# EAGLE design ESP32 Miner LCD-2.4 inch  V1.0 251225(1) (EAGLE 9.5.1)
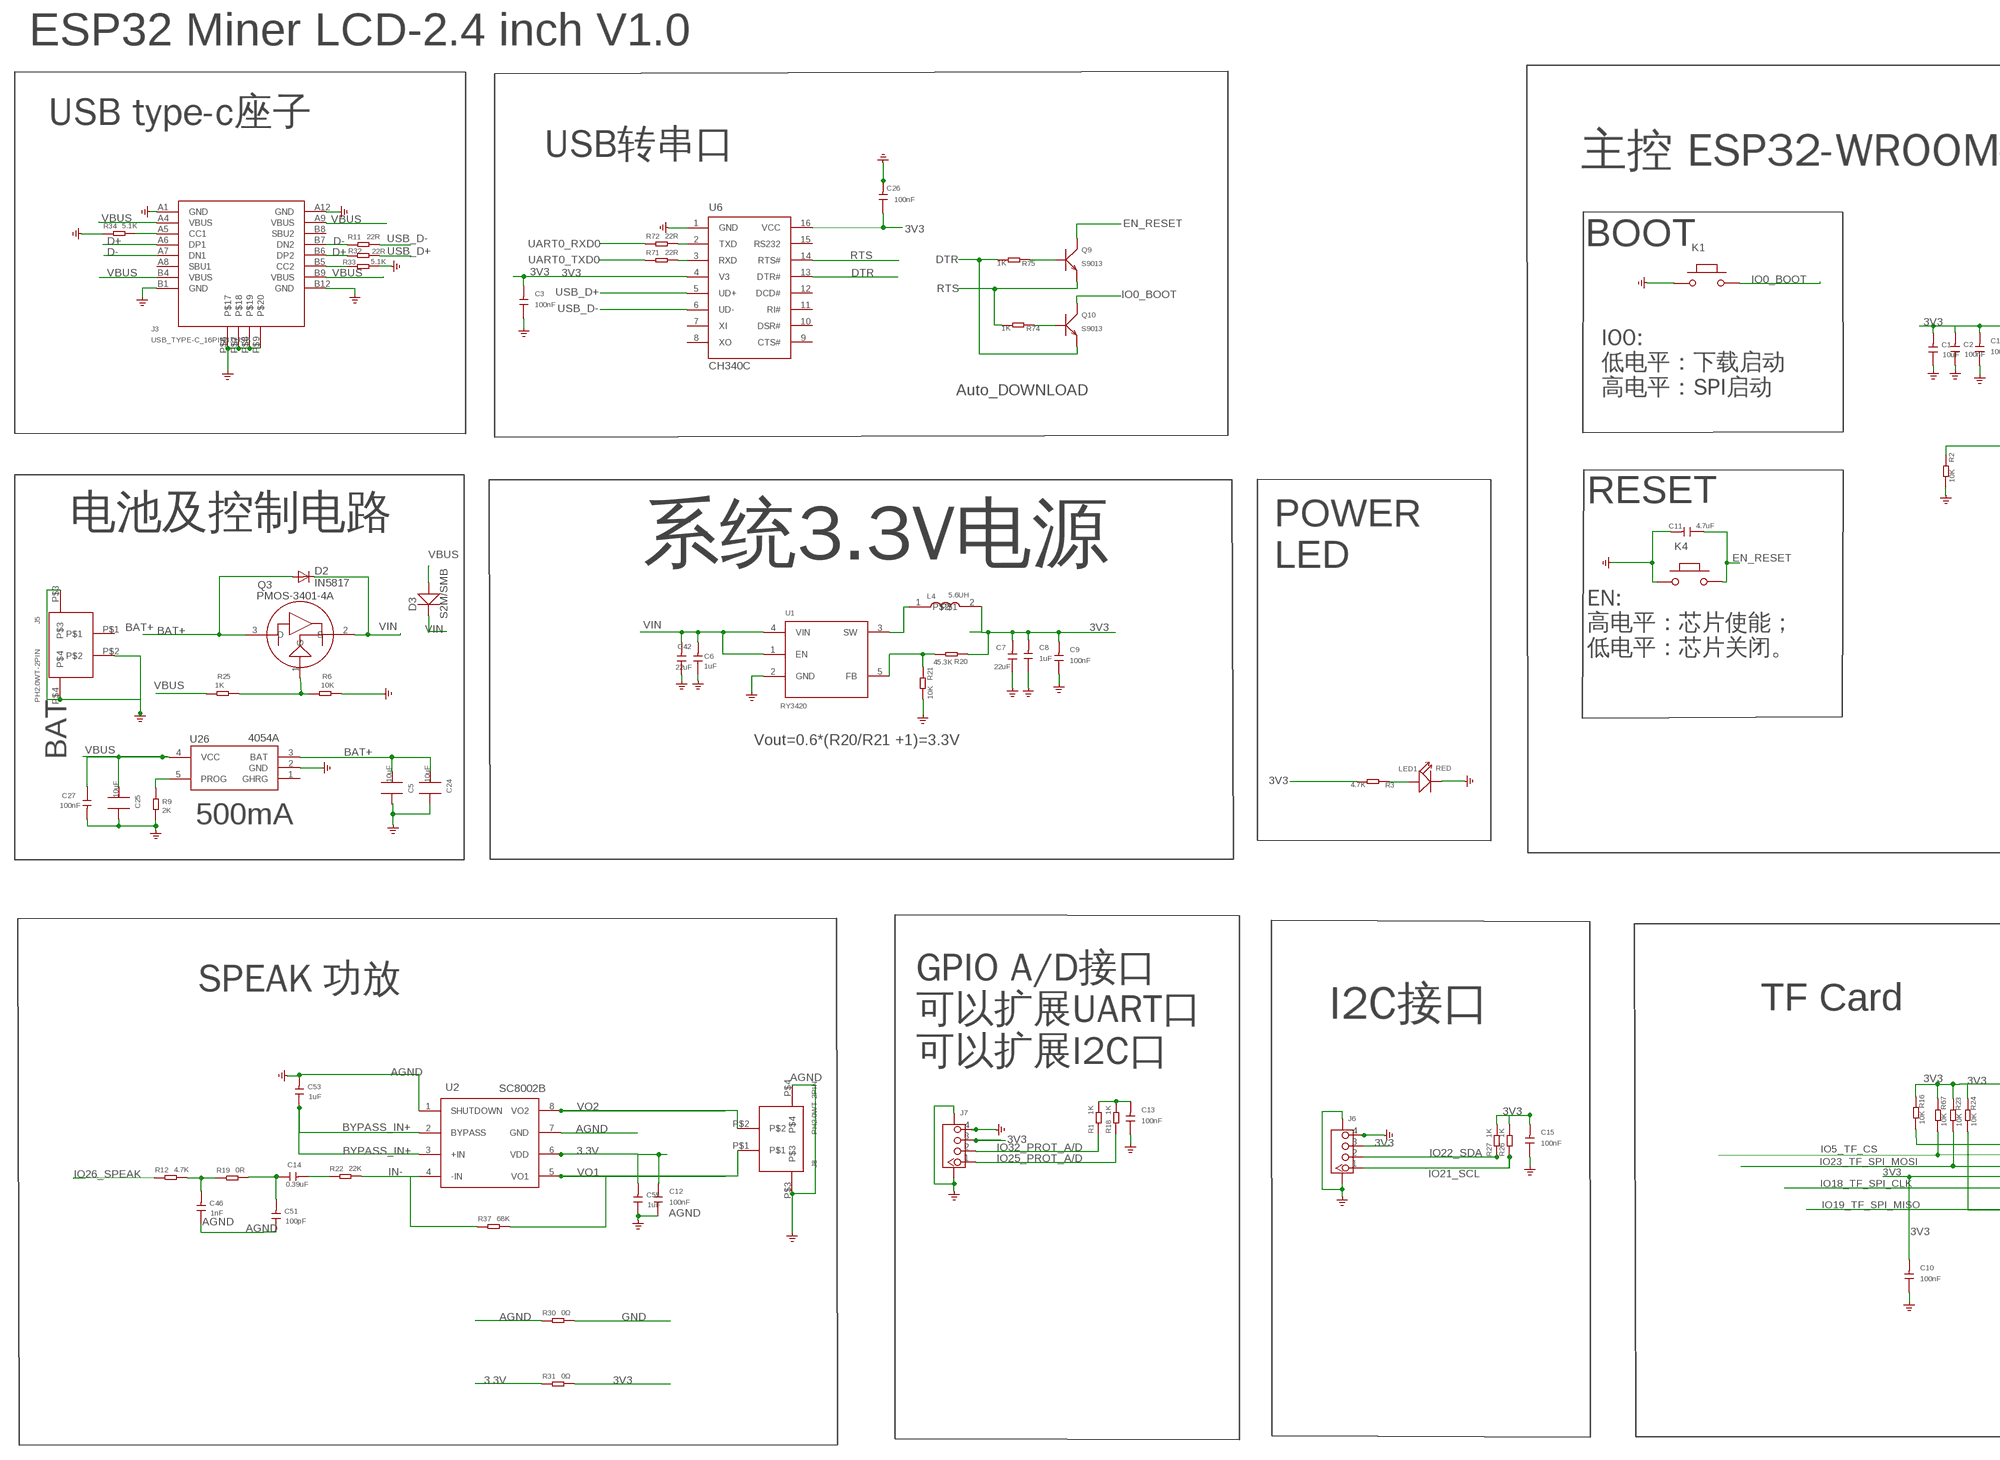
[diagram p0: schematic, sheet 1, part 1 of 2]
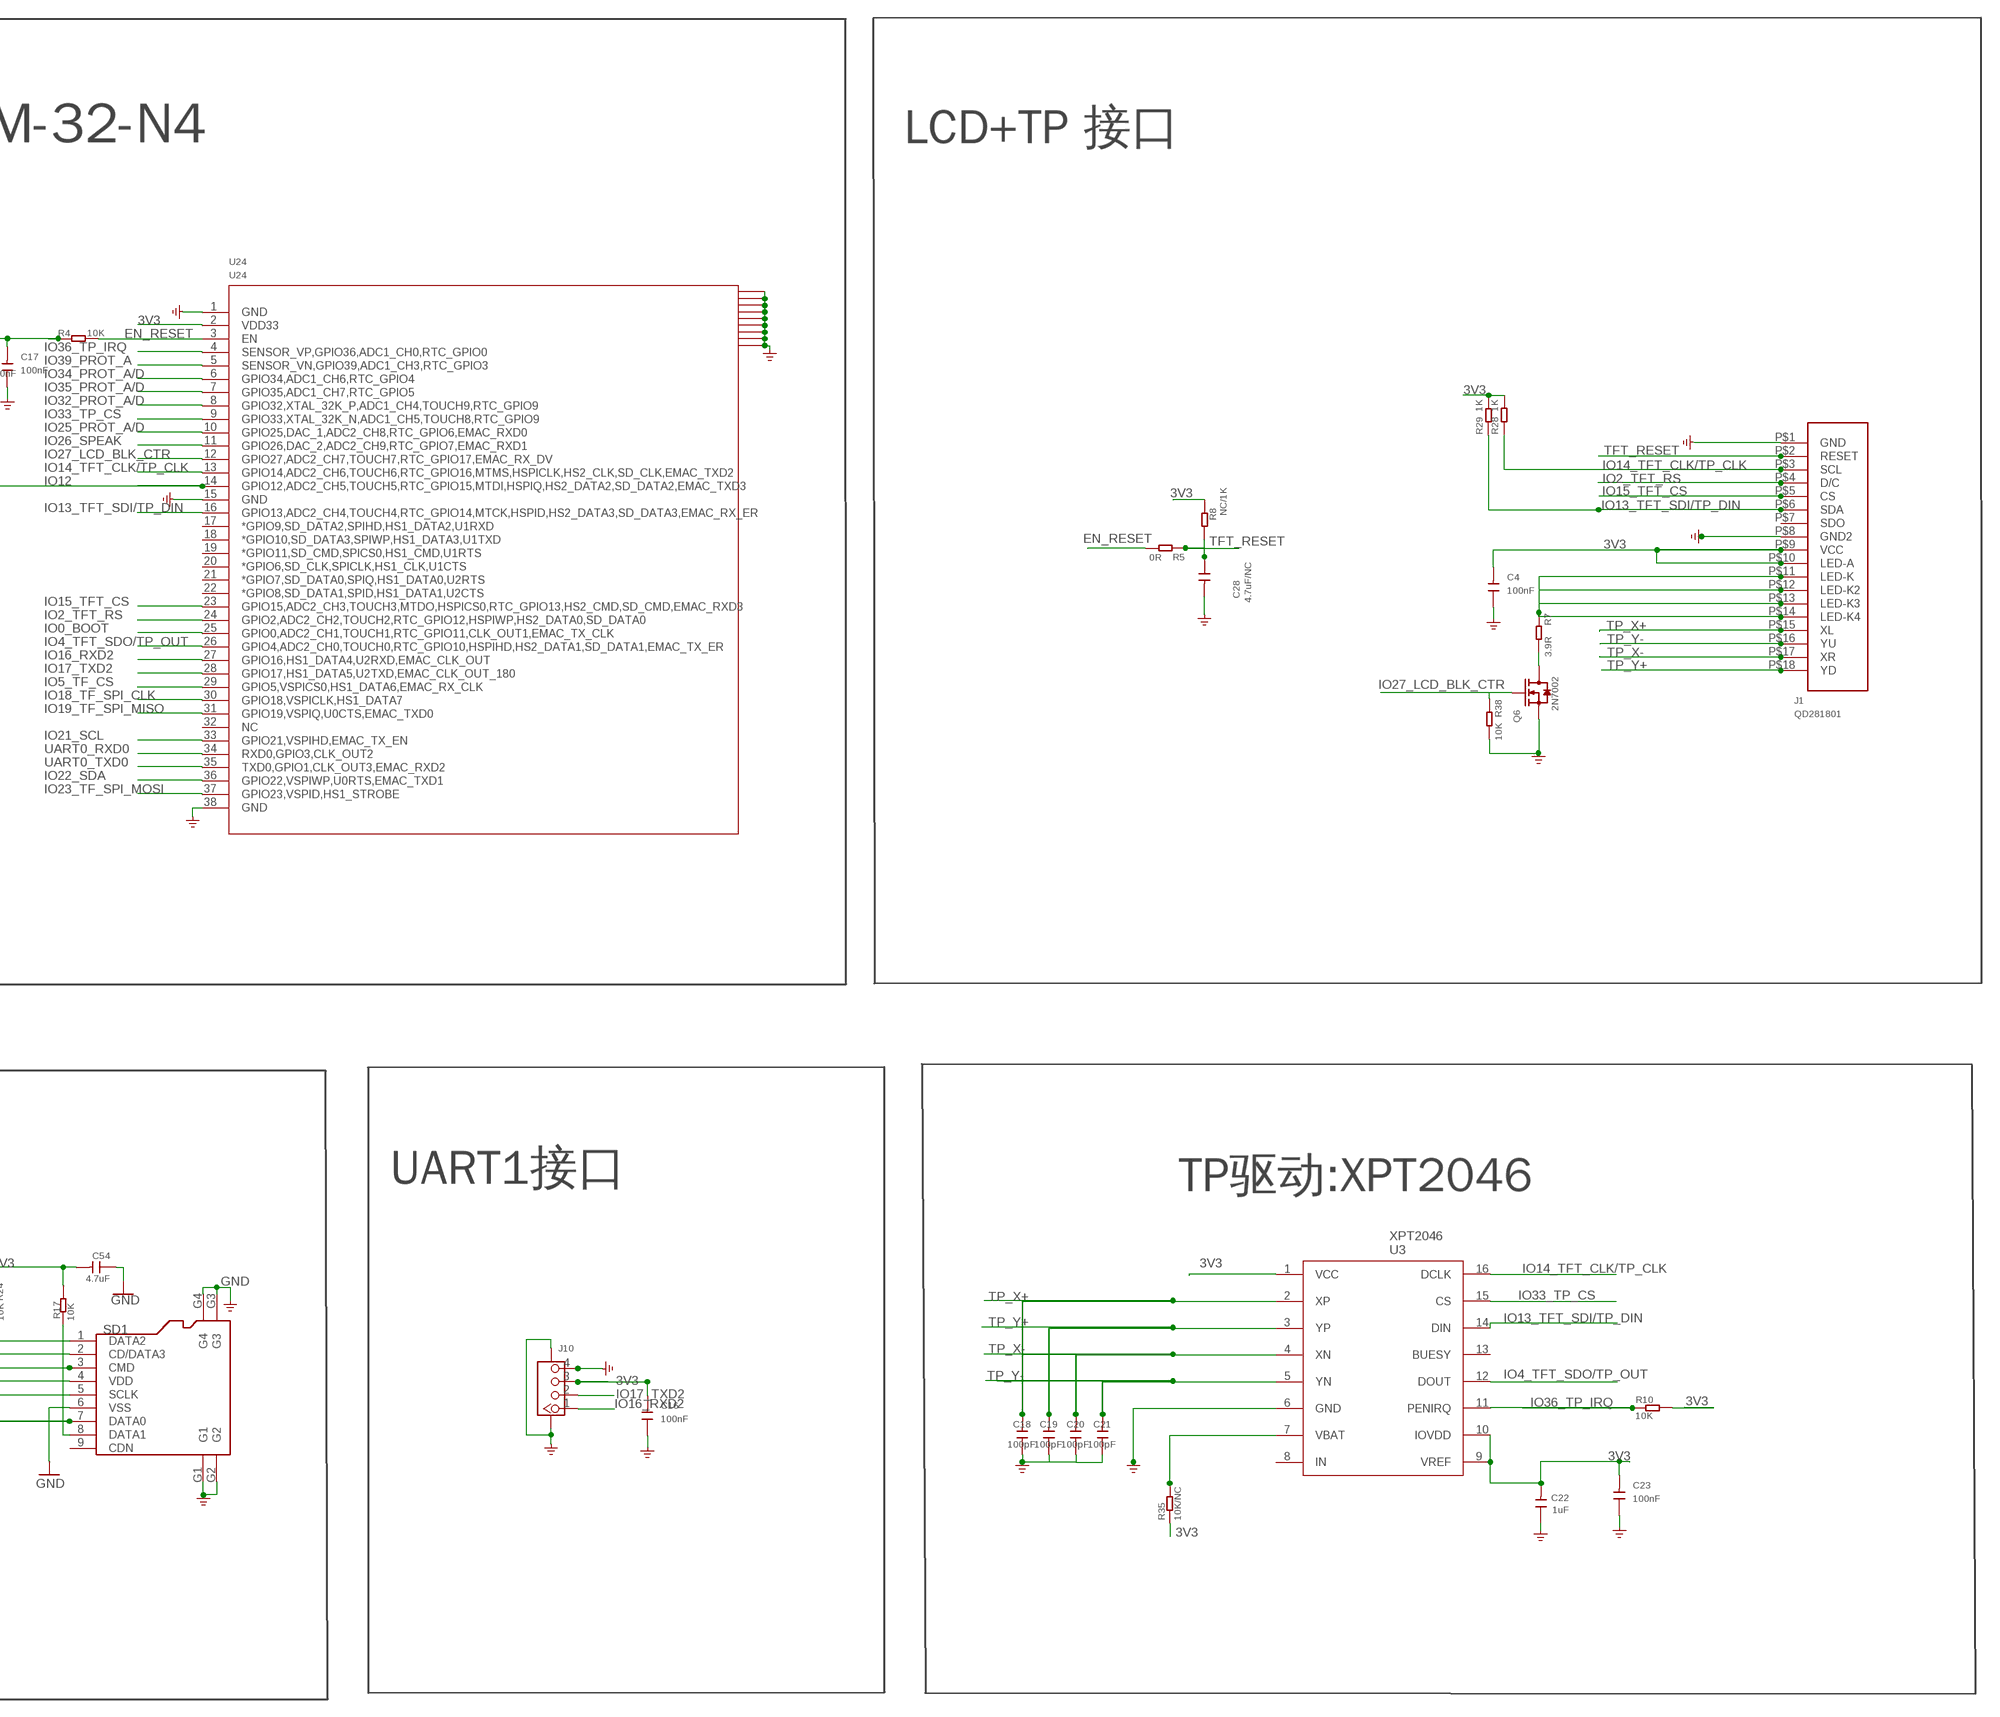
[diagram p1: schematic, sheet 1, part 2 of 2]

## Parts
C1  10uF  DISCRETE_C-0603  [DISCRETE_C0603]
C2  100nF  DISCRETE_C-0603  [DISCRETE_C0603]
C3  100nF  C0603  [0603]
C4  100nF  C0603  [0603]
C5  10uF  C0805_S  [0805_S]
C6  1uF  C0603  [0603]
C7  22uF  C0805  [0805]
C8  1uF  C0603  [0603]
C9  100nF  C0603  [0603]
C10  100nF  C0603  [0603]
C11  4.7uF  C0603  [0603]
C12  100nF  C0603  [0603]
C13  100nF  C0603  [0603]
C14  0.39uF  DISCRETE_C-0603  [DISCRETE_C0603]
C15  100nF  C0603  [0603]
C16  100nF  C0603  [0603]
C17  100nF  C0603  [0603]
C18  100pF  C0603  [0603]
C19  100pF  C0603  [0603]
C20  100pF  C0603  [0603]
C21  100pF  C0603  [0603]
C22  1uF  DISCRETE_C-0603  [DISCRETE_C0603]
C23  100nF  C0603  [0603]
C24  10uF  C0805_S  [0805_S]
C25  10uF  C0805_S  [0805_S]
C26  100nF  C0603  [0603]
C27  100nF  C-0603  [C0603]
C28  4.7uF/NC  C0603  [0603]
C42  22uF  C0805  [0805]
C46  1nF  DISCRETE_C-0603  [DISCRETE_C0603]
C51  100pF  DISCRETE_C-0603  [DISCRETE_C0603]
C53  1uF  DISCRETE_C-0603  [DISCRETE_C0603]
C54  4.7uF  DISCRETE_C-0603  [DISCRETE_C0603]
C55  1uF  DISCRETE_C-0603  [DISCRETE_C0603]
D2  IN5817  DIODE-DO-214AC  [DO-214AC]
D3  S2M/SMB  214ABDO-214AB  [214AB]
J1  QD281801  [QD241801-18PIN*0.8]
J3  USB_TYPE-C_16PIN3.0USB  [KEVIN_3.0TYPEC-SMD]
J5  PH2.0WT-2PIN  [PH2.0WT-2PIN]
J6  CONNECTOR_TWIG-4P-2.0-SMD-FEMALE-REINFORCE90D  [CONNECTOR_4P-SMD-2.0-90D]
J7  CONNECTOR_TWIG-4P-2.0-SMD-FEMALE-REINFORCE90D  [CONNECTOR_4P-SMD-2.0-90D]
J8  PH2.0WT-2PIN  [PH2.0WT-2PIN]
J10  CONNECTOR_TWIG-4P-2.0-SMD-FEMALE-REINFORCE90D  [CONNECTOR_4P-SMD-2.0-90D]
K1  BUTTON  PB157  [157SW]
K4  BUTTON  PB157  [157SW]
L4  5.6UH  L-0530  [CD54_CD54]
LED1  RED  DISCRETE_LED0603  [DISCRETE_LED-0603]
Q3  PMOS-3401-4A  P-MOS-SOT23  [SOT-23]
Q6  2N7002  MOSFET-N'SOT23'  [SOT23]
Q9  S9013  TRANSISTOR-NPN-SOT23  [SOT23@1]
Q10  S9013  TRANSISTOR-NPN-SOT23  [SOT23@1]
R1  1K  DISCRETE_R-0603  [DISCRETE_R0603]
R2  10K  DISCRETE_R-0603  [DISCRETE_R0603]
R3  4.7K  DISCRETE_R-0603  [DISCRETE_R0603]
R4  10K  R0603  [R0603]
R5  0R  DISCRETE_R-0603  [DISCRETE_R0603]
R6  10K  DISCRETE_R-0603  [DISCRETE_R0603]
R7  3.9R  DISCRETE_R-0603  [DISCRETE_R0603]
R8  NC/1K  DISCRETE_R-0603  [DISCRETE_R0603]
R9  2K  DISCRETE_R-0603  [DISCRETE_R0603]
R10  10K  DISCRETE_R-0603  [DISCRETE_R0603]
R11  22R  DISCRETE_R-0603  [DISCRETE_R0603]
R12  4.7K  DISCRETE_R-0603  [DISCRETE_R0603]
R16  10K  DISCRETE_R-0603  [DISCRETE_R0603]
R17  10K  DISCRETE_R-0603  [DISCRETE_R0603]
R18  1K  DISCRETE_R-0603  [DISCRETE_R0603]
R19  0R  DISCRETE_R-0603  [DISCRETE_R0603]
R20  45.3K  DISCRETE_R-0603  [DISCRETE_R0603]
R21  10K  DISCRETE_R-0603  [DISCRETE_R0603]
R22  22K  DISCRETE_R-0603  [DISCRETE_R0603]
R23  10K  DISCRETE_R-0603  [DISCRETE_R0603]
R24  10K  DISCRETE_R-0603  [DISCRETE_R0603]
R25  1K  DISCRETE_R-0603  [DISCRETE_R0603]
R26  1K  DISCRETE_R-0603  [DISCRETE_R0603]
R27  1K  DISCRETE_R-0603  [DISCRETE_R0603]
R28  1K  DISCRETE_R-0603  [DISCRETE_R0603]
R29  1K  DISCRETE_R-0603  [DISCRETE_R0603]
R30  0Ω  DISCRETE_R-0603  [DISCRETE_R0603]
R31  0Ω  DISCRETE_R-0603  [DISCRETE_R0603]
R32  22R  DISCRETE_R-0603  [DISCRETE_R0603]
R33  5.1K  DISCRETE_R-0603  [DISCRETE_R0603]
R34  5.1K  DISCRETE_R-0603  [DISCRETE_R0603]
R35  10K/NC  DISCRETE_R-0603  [DISCRETE_R0603]
R37  68K  DISCRETE_R-0603  [DISCRETE_R0603]
R38  10K  DISCRETE_R-0603  [DISCRETE_R0603]
R67  10K  DISCRETE_R-0603  [DISCRETE_R0603]
R71  22R  DISCRETE_R-0603  [DISCRETE_R0603]
R72  22R  DISCRETE_R-0603  [DISCRETE_R0603]
R74  1K  DISCRETE_R-0603  [DISCRETE_R0603]
R75  1K  DISCRETE_R-0603  [DISCRETE_R0603]
SD1  HOLDER-MICROSD-9P  [9P-SMD-W/-RING]
U1  RY3420  A_XBJ_HM3420B  [A_XBJ_SOT23-5]
U2  SC8002B  SC8002BSC8002B-SOP8  [AT24C02_SOP8]
U3  XPT2046  [XP2046-SSOP16]
U6  CH340C  CH340G  [SOP-16]
U24  U24  ESP32-WROOM-32-N4  [ESP32-WROOM-32-N4]
U26  4054A  [SOP23-5]

## Nets
3.3V: C12.2 C55.2 R31.1 U2.6(VDD)
3V3: C1.2 C2.2 C3.2 C4.2 C7.2 C8.2 C9.2 C10.2 C13.2 C15.2 C16.2 C17.2 C22.2 C23.2 C26.1 C54.2 J1.P$9(VCC) J1.P$10(LED-A) J6.3 J7.3 J10.3 L4.2 R1.2 R3.2 R4.1 R8.2 R10.2 R16.1 R17.1 R18.2 R20.1 R23.1 R24.1 R26.2 R27.2 R28.2 R29.2 R31.2 R35.1 R67.1 SD1.4(VDD) U3.1(VCC) U3.9(VREF) U3.10(IOVDD) U6.4(V3) U6.16(VCC) U24.2(VDD33)
AGND: C12.1 C46.1 C51.1 C53.2 C55.1 J8.P$3 J8.P$4 R30.1 U2.1(SHUTDOWN) U2.7(GND) ; supply symbol labelled GND
BAT+: C5.2 C24.2 D2.A J5.P$1 Q3.3(D) U26.3(BAT)
BYPASS_IN+: C53.1 U2.2(BYPASS) U2.3(+IN)
D+: J3.A6(DP1) J3.B6(DP2) R32.1
D-: J3.A7(DN1) J3.B7(DN2) R11.1
DTR: Q10.2(E) R75.2 U6.13(DTR#)
EN_RESET: C11.1 K4.2 Q9.3(C) R4.2 R5.2 U24.3(EN)
GND: C1.1 C2.1 C3.1 C4.1 C5.1 C6.1 C7.1 C8.1 C9.1 C10.1 C11.2 C13.1 C15.1 C16.1 C17.1 C18.1 C19.1 C20.1 C21.1 C22.1 C23.1 C24.1 C25.1 C26.2 C27.2 C28.2 C42.1 C54.1 J1.P$1(GND) J1.P$8(GND2) J3.A1(GND) J3.A12(GND) J3.B1(GND) J3.B12(GND) J3.P$6 J3.P$7 J3.P$8 J3.P$9 J5.P$2 J5.P$3 J5.P$4 J6.4 J6.SS1 J6.SS2 J7.4 J7.SS1 J7.SS2 J10.4 J10.SS1 J10.SS2 K1.1 K4.1 LED1.- Q6.2(S) R2.2 R6.1 R9.2 R21.2 R30.2 R33.2 R34.1 R38.2 SD1.6(VSS) SD1.G1 SD1.G2 SD1.G3 SD1.G4 U1.2(GND) U3.6(GND) U6.1(GND) U24.1(GND) U24.15(GND) U24.38(GND) U24.41(GND) U24.42(GND) U24.43(GND) U24.44(GND) U24.45(GND) U24.46(GND) U24.47(GND) U24.48(GND) U24.49(GND) U26.2(GND)
IN-: R22.2 R37.1 U2.4(-IN)
IO0_BOOT: K1.2 Q10.3(C) U24.25(GPIO0,ADC2_CH1,TOUCH1,RTC_GPIO11,CLK_OUT1,EMAC_TX_CLK)
IO2_TFT_RS: J1.P$4(D/C) U24.24(GPIO2,ADC2_CH2,TOUCH2,RTC_GPIO12,HSPIWP,HS2_DATA0,SD_DATA0)
IO4_TFT_SDO/TP_OUT: U3.12(DOUT) U24.26(GPIO4,ADC2_CH0,TOUCH0,RTC_GPIO10,HSPIHD,HS2_DATA1,SD_DATA1,EMAC_TX_ER)
IO5_TF_CS: R67.2 SD1.2(CD/DATA3) U24.29(GPIO5,VSPICS0,HS1_DATA6,EMAC_RX_CLK)
IO12: R2.1 U24.14(GPIO12,ADC2_CH5,TOUCH5,RTC_GPIO15,MTDI,HSPIQ,HS2_DATA2,SD_DATA2,EMAC_TXD3)
IO13_TFT_SDI/TP_DIN: J1.P$6(SDA) R29.1 U3.14(DIN) U24.16(GPIO13,ADC2_CH4,TOUCH4,RTC_GPIO14,MTCK,HSPID,HS2_DATA3,SD_DATA3,EMAC_RX_ER)
IO14_TFT_CLK/TP_CLK: J1.P$3(SCL) R28.1 U3.16(DCLK) U24.13(GPIO14,ADC2_CH6,TOUCH6,RTC_GPIO16,MTMS,HSPICLK,HS2_CLK,SD_CLK,EMAC_TXD2)
IO15_TFT_CS: J1.P$5(CS) U24.23(GPIO15,ADC2_CH3,TOUCH3,MTDO,HSPICS0,RTC_GPIO13,HS2_CMD,SD_CMD,EMAC_RXD3)
IO16_RXD2: J10.1 U24.27(GPIO16,HS1_DATA4,U2RXD,EMAC_CLK_OUT)
IO17_TXD2: J10.2 U24.28(GPIO17,HS1_DATA5,U2TXD,EMAC_CLK_OUT_180)
IO18_TF_SPI_CLK: SD1.5(SCLK) U24.30(GPIO18,VSPICLK,HS1_DATA7)
IO19_TF_SPI_MISO: R24.2 SD1.7(DATA0) U24.31(GPIO19,VSPIQ,U0CTS,EMAC_TXD0)
IO21_SCL: J6.1 R26.1 U24.33(GPIO21,VSPIHD,EMAC_TX_EN)
IO22_SDA: J6.2 R27.1 U24.36(GPIO22,VSPIWP,U0RTS,EMAC_TXD1)
IO23_TF_SPI_MOSI: R23.2 SD1.3(CMD) U24.37(GPIO23,VSPID,HS1_STROBE)
IO25_PROT_A/D: J7.1 R18.1 U24.10(GPIO25,DAC_1,ADC2_CH8,RTC_GPIO6,EMAC_RXD0)
IO26_SPEAK: R12.1 U24.11(GPIO26,DAC_2,ADC2_CH9,RTC_GPIO7,EMAC_RXD1)
IO27_LCD_BLK_CTR: Q6.1(G) R38.1 U24.12(GPIO27,ADC2_CH7,TOUCH7,RTC_GPIO17,EMAC_RX_DV)
IO32_PROT_A/D: J7.2 R1.1 U24.8(GPIO32,XTAL_32K_P,ADC1_CH4,TOUCH9,RTC_GPIO9)
IO33_TP_CS: U3.15(CS) U24.9(GPIO33,XTAL_32K_N,ADC1_CH5,TOUCH8,RTC_GPIO9)
IO34_PROT_A/D: U24.6(GPIO34,ADC1_CH6,RTC_GPIO4)
IO35_PROT_A/D: U24.7(GPIO35,ADC1_CH7,RTC_GPIO5)
IO36_TP_IRQ: R10.1 U3.11(PENIRQ) U24.4(SENSOR_VP,GPIO36,ADC1_CH0,RTC_GPIO0)
IO39_PROT_A: U24.5(SENSOR_VN,GPIO39,ADC1_CH3,RTC_GPIO3)
N$1: LED1.+ R3.1
N$2: Q6.3(D) R7.2
N$3: C46.2 R12.2 R19.1
N$4: R35.2 U3.7(VBAT)
N$6: R9.1 U26.5(PROG)
N$12: J1.P$11(LED-K) J1.P$12(LED-K2) J1.P$13(LED-K3) J1.P$14(LED-K4) R7.1
N$13: L4.1 U1.3(SW)
N$14: J3.B5(CC2) R33.1
N$16: J3.A5(CC1) R34.2
N$17: Q3.1(G) R6.2 R25.1
N$20: R20.2 R21.1 U1.5(FB)
N$26: C14.1 C51.2 R19.2
N$29: C14.2 R22.1
N$32: Q9.1(B) R75.1
N$38: Q10.1(B) R74.1
N$40: R72.2 U6.2(TXD)
N$42: R71.2 U6.3(RXD)
N$47: R16.2 SD1.1(DATA2)
N$48: R17.2 SD1.8(DATA1)
RTS: Q9.2(E) R74.2 U6.14(RTS#)
TFT_RESET: C28.1 J1.P$2(RESET) R5.1 R8.1
TP_X+: C18.2 J1.P$15(XL) U3.2(XP)
TP_X-: C20.2 J1.P$17(XR) U3.4(XN)
TP_Y+: C19.2 J1.P$18(YD) U3.3(YP)
TP_Y-: C21.2 J1.P$16(YU) U3.5(YN)
UART0_RXD0: R72.1 U24.34(RXD0,GPIO3,CLK_OUT2)
UART0_TXD0: R71.1 U24.35(TXD0,GPIO1,CLK_OUT3,EMAC_RXD2)
USB_D+: R32.2 U6.5(UD+)
USB_D-: R11.2 U6.6(UD-)
VBUS: C25.2 C27.1 D3.1(+) J3.A4(VBUS) J3.A9(VBUS) J3.B4(VBUS) J3.B9(VBUS) R25.2 U26.4(VCC)
VIN: C6.2 C42.2 D2.C D3.2(-) Q3.2(S) U1.1(EN) U1.4(VIN)
VO1: J8.P$1 R37.2 U2.5(VO1)
VO2: J8.P$2 U2.8(VO2)
Unconnected: J1.P$7(SDO) J3.A8(SBU1) J3.B8(SBU2) SD1.9(CDN) U3.8(IN) U3.13(BUESY) U6.7(XI) U6.8(XO) U6.9(CTS#) U6.10(DSR#) U6.11(RI#) U6.12(DCD#) U6.15(RS232) U24.17(*GPIO9,SD_DATA2,SPIHD,HS1_DATA2,U1RXD) U24.18(*GPIO10,SD_DATA3,SPIWP,HS1_DATA3,U1TXD) U24.19(*GPIO11,SD_CMD,SPICS0,HS1_CMD,U1RTS) U24.20(*GPIO6,SD_CLK,SPICLK,HS1_CLK,U1CTS) U24.21(*GPIO7,SD_DATA0,SPIQ,HS1_DATA0,U2RTS) U24.22(*GPIO8,SD_DATA1,SPID,HS1_DATA1,U2CTS) U24.32(NC) U26.1(GHRG)

## Notes on the sheet
- ESP32 Miner LCD-2.4 inch V1.0
- USB type-c座子
- USB转串口 | 主控 ESP32-WROOM-32-N4 | LCD+TP 接口
- BOOT
- IO0:
  低电平：下载启动
  高电平：SPI启动
- Auto_DOWNLOAD
- RESET
- 电池及控制电路
- 系统3.3V电源
- POWER
  LED
- EN:
  高电平：芯片使能；
  低电平：芯片关闭。
- Vout=0.6*(R20/R21 +1)=3.3V
- BAT
- 500mA
- SPEAK 功放
- I2C接口 | TF Card | UART1接口
- TP驱动:XPT2046
- GPIO A/D接口
  可以扩展UART口
  可以扩展I2C口

## Library data of the parts
C1 C2 C14 C22 C46 C51 C53 C55 = A_xbj:DISCRETE_C*: Ceramic Capacitors
C3 C4 C6 C8-C13 C15-C21 C23 C26 C28 = A_xbj:C0603
C5 C24 C25 = CPT_SMD:C0805
C7 C42 = A_xbj:C0805
C27 = discrete:C*: Ceramic Capacitors
C54 = A9G:DISCRETE_C*: Ceramic Capacitors
D2 = diode:DIODE-: DIODE
D3 = DO-214AB:214AB: 214AB
J1 = cooper:QD281801
J3 = WZ3532R024-ESP32-V0.1-20221226:USB_TYPE-C_16PIN
J5 J8 = cooper:PH2.0WT-2PIN
J6 J7 J10 = A_xbj:CONNECTOR_TWIG-4P-2.0-SMD-FEMALE-REINFORCE
K1 K4 = MySMD:PB157
L4 = WZ2432R028-ESP32-V1.2-20231108:L-0530
LED1 = A_xbj:DISCRETE_LED*
Q3 = DFN8:P-MOS-SOT23
Q6 = discrete:MOSFET-N: IRLL014: http://www.vishay.com/docs/91319/sihll014.pdf
Q9 Q10 = discrete:TRANSISTOR-NPN*: NPN audion
R1-R3 R5 R7 R8 R11 R12 R16-R24 R26-R34 R37 R38 R67 R71 R72 R74 R75 = Crowtail-_LED-V2.0-20190615-01:DISCRETE_R*
R4 = A_xbj:R0603
R6 R9 R10 R25 R35 = A9G:DISCRETE_R*
SD1 = Connector:HOLDER-MICROSD-9P
U1 = CrowBot_-V1.0-20220525:A_XBJ_HM3420B
U2 = cooper:SC8002B
U3 = cooper:XPT2046
U6 = A_xbj:CH340G
U24 = cooper:ESP32-WROOM-32-N4
U26 = DFN8:4054A

## Net classes
0 default: width 0.152 mm, drill 0.305 mm, clearance 0.203 mm

## Board
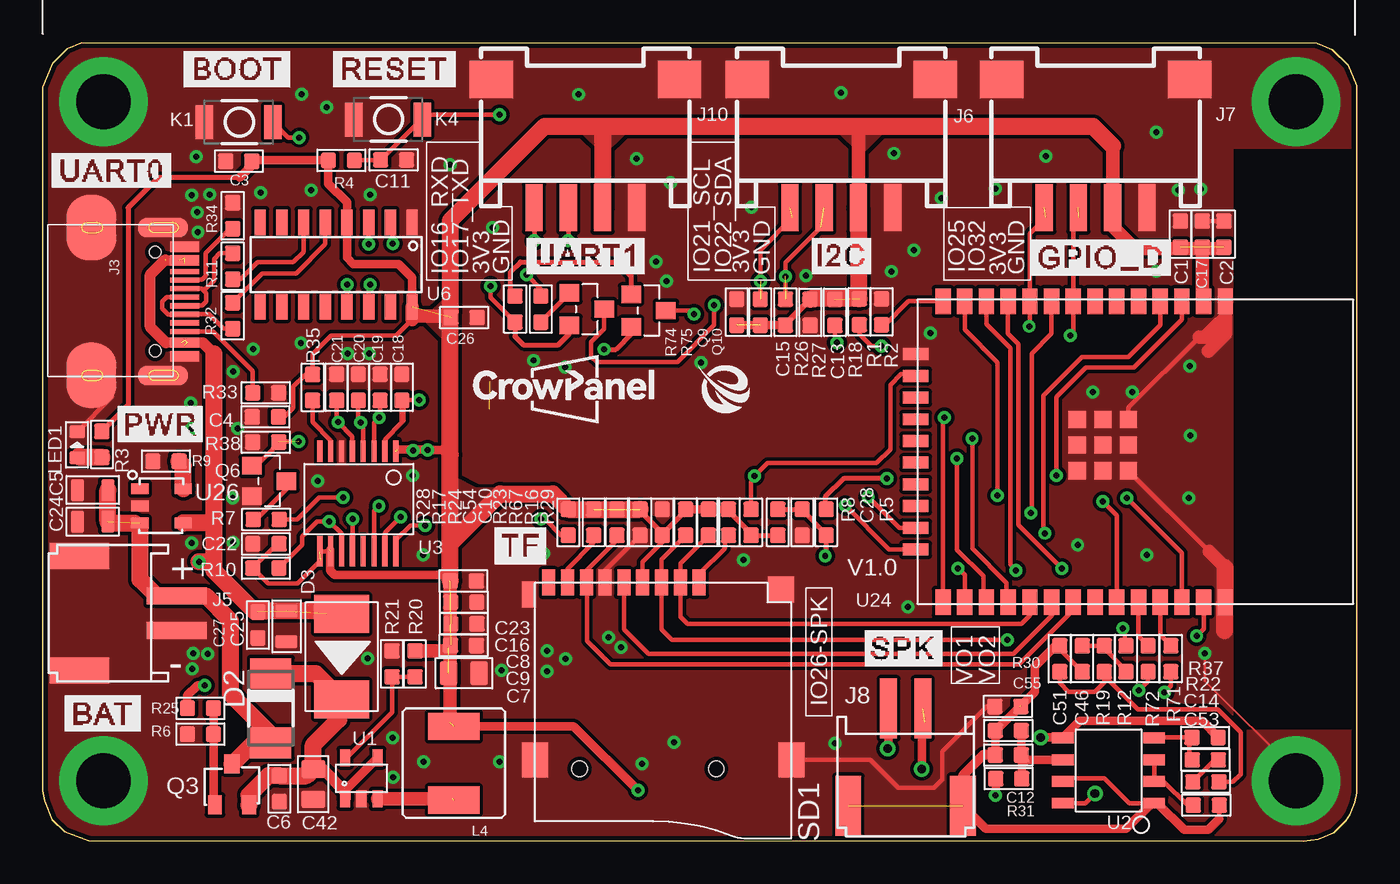
[diagram p2: board, top side]
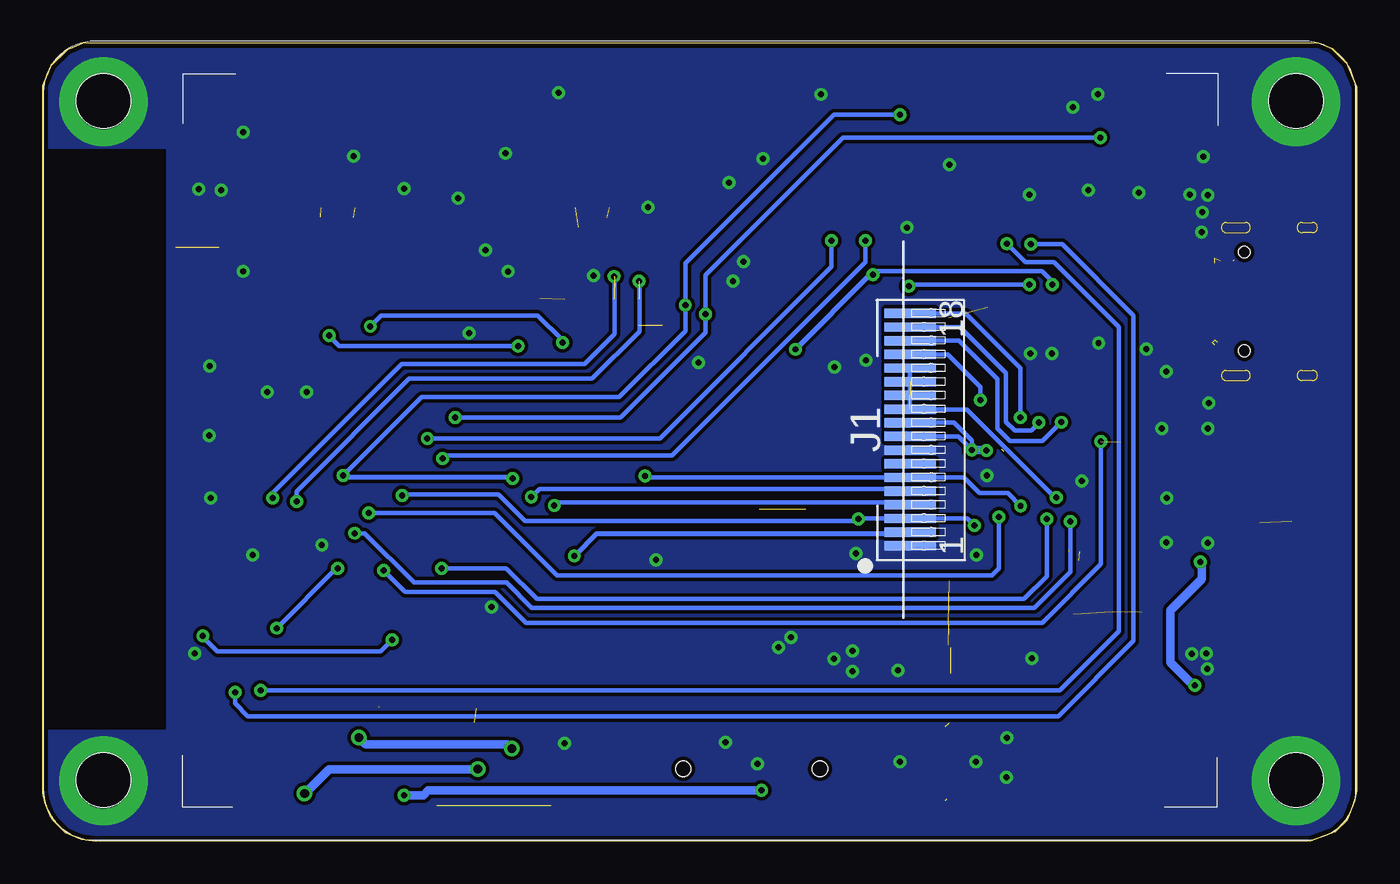
[diagram p3: board, bottom side, seen from below]

Size 76.85 x 46.71 mm. Coordinates in mm from the lower left corner, seen from the top.
Outline: 2.27,46.71 74.52,46.69 75.43,46.31 76.35,45.38 76.85,44.18 76.85,2.84 76.74,2.26 76.44,1.54 76.2,1.18 75.52,0.5 74.61,0.13 73.72,0 2.68,0.02 1.28,0.55 0.57,1.27 0.11,2.36 0,2.94 0,44.11 0.58,45.52 1.42,46.36 2.27,46.71
Copper layers (1*16): Top 0.035mm / dielectric 1.5mm / Bottom 0.035mm
Design rules "default *": minimum track width 6mil, minimum drill 0.35mm, track to track 6mil, track to pad 5mil, pad to pad 5mil, via to via 6mil, smd to smd 6mil, copper to edge 10mil, drill to drill 10mil, minimum pad ring 10mil, minimum via ring 8mil, stop-mask expansion 4mil, vias tented up to drill 100mil, thermal gap 0mil

### Footprints (pad centres in the part's own frame; a part is rotated, then mirrored left to right if it is on the bottom)
DISCRETE_C0603 = smd 0.889 x 0.889: 1 -0.762,0; 2 0.762,0
0603 = smd 0.889 x 0.889: 1 -0.762,0; 2 0.762,0
0805_S = smd 0.762 x 1.27: 1 -0.889,0; 2 0.889,0
0805 = smd 1.016 x 1.397: 1 -0.889,0; 2 0.889,0
C0603 = smd 0.889 x 0.889: 1 -0.762,0; 2 0.762,0
DO-214AC = smd 1.8 x 2.4: A 2.025,0; C -2.025,0
214AB = smd 2.2 x 3.2: 1 -2.5,0; 2 2.5,0
QD241801-18PIN*0.8 = smd 0.55 x 3: P$1 -6.789,-1.538; P$2 -5.989,-1.538; P$3 -5.189,-1.538; P$4 -4.389,-1.538; P$5 -3.589,-1.538; P$6 -2.789,-1.538; P$7 -1.989,-1.538; P$8 -1.189,-1.538; P$9 -0.389,-1.538; P$10 0.411,-1.538; P$11 1.211,-1.538; P$12 2.011,-1.538; P$13 2.811,-1.538; P$14 3.611,-1.538; P$15 4.411,-1.538; P$16 5.211,-1.538; P$17 6.011,-1.538; P$18 6.811,-1.538
KEVIN_3.0TYPEC-SMD = smd 0.3 x 1.7: A1 -3.35,0.5; A4 -2.55,0.5; A5 -1.25,0.5; A6 -0.25,0.5; A7 0.25,0.5; A8 1.25,0.5; A9 2.55,0.5; A12 3.35,0.5; B1 3.05,0.5; B4 2.25,0.5; B5 1.75,0.5; B6 0.75,0.5; B7 -0.75,0.5; B8 -1.75,0.5; B9 -2.25,0.5; B12 -3.05,0.5 | smd 1.143 x 2.921: P$6 -4.318,-0.762; P$7 4.318,-0.762 | smd 3.81 x 2.921: P$8 -4.318,-4.953; P$9 4.318,-4.953 | hole 0.68: -2.89,-1.22; 2.89,-1.22
PH2.0WT-2PIN = smd 1 x 3.5: P$1 -1,0; P$2 1,0 | smd 1.5 x 3.5: P$3 -3.35,-5.7; P$4 3.35,-5.7
CONNECTOR_4P-SMD-2.0-90D = smd 1.01 x 2.74: 1 -3,-0.1; 2 -1,-0.1; 3 1,-0.1; 4 3,-0.1 | smd 2.54 x 2.184: SS1 -5.5,7.4; SS2 5.5,7.4
157SW = smd 1.016 x 1.981: 1 0,0; 2 4,0
CD54_CD54 = smd 3 x 1.6: 1 0,2.159; 2 0,-2.159
DISCRETE_LED-0603 = smd 0.762 x 0.889: + -0.762,0; - 0.762,0
SOT-23 = smd 1.1 x 0.8: 1 1.2,-1; 2 1.2,1 | smd 1.1 x 0.9: 3 -1.2,0
SOT23 = smd 1.016 x 1.143: 1 -0.889,-1.016; 2 0.889,-1.016; 3 0,1.016
SOT23@1 = smd 1.016 x 1.143: 1 -0.95,-1.016; 2 0.95,-1.016; 3 0,1.016
DISCRETE_R0603 = smd 0.889 x 0.889: 1 -0.762,0; 2 0.762,0
R0603 = smd 0.889 x 0.889: 1 -0.762,0; 2 0.762,0
9P-SMD-W/-RING = smd 1.524 x 0.762: 1 0,4.4; 2 0,3.3; 3 0,2.2; 4 0,1.1; 5 0,0; 6 0,-1.1; 7 0,-2.2; 8 0,-3.3; 9 0,-4.4 | smd 1.524 x 0.8: G1 0.7,-5.546 | smd 2.032 x 1.524: G2 10.373,-5.2; G3 10.373,9.8 | smd 1.524 x 1.524: G4 0.392,9.181 | hole 0.889: 10.9,-2.6; 10.9,5.4
A_XBJ_SOT23-5 = smd 0.6 x 1: 1 -0.95,-1.2; 2 0,-1.2; 3 0.95,-1.2; 4 0.95,1.2; 5 -0.95,1.2
AT24C02_SOP8 = smd 0.635 x 1.27: 1 -1.905,-2.667; 2 -0.635,-2.667; 3 0.635,-2.667; 4 1.905,-2.667; 5 1.905,2.667; 6 0.635,2.667; 7 -0.635,2.667; 8 -1.905,2.667
XP2046-SSOP16 = smd 0.305 x 1.27: 1 -2.54,-2.54; 2 -1.905,-2.54; 3 -1.27,-2.54; 4 -0.635,-2.54; 5 0,-2.54; 6 0.635,-2.54; 7 1.27,-2.54; 8 1.905,-2.54 | smd 0.305 x 1.778: 9 1.905,3.302; 10 1.27,3.302; 11 0.635,3.302; 12 0,3.302; 13 -0.635,3.302; 14 -1.27,3.302; 15 -1.905,3.302; 16 -2.54,3.302
SOP-16 = smd 0.66 x 1.5: 1 -4.445,-2.475; 2 -3.175,-2.475; 3 -1.905,-2.475; 4 -0.635,-2.475; 5 0.635,-2.475; 6 1.905,-2.475; 7 3.175,-2.475; 8 4.445,-2.475; 9 4.445,2.475; 10 3.175,2.475; 11 1.905,2.475; 12 0.635,2.475; 13 -0.635,2.475; 14 -1.905,2.475; 15 -3.175,2.475; 16 -4.445,2.475
ESP32-WROOM-32-N4 = smd 1.5 x 0.9: 1 -8.898,6.761; 2 -8.898,5.491; 3 -8.898,4.221; 4 -8.898,2.951; 5 -8.898,1.681; 6 -8.898,0.411; 7 -8.898,-0.859; 8 -8.898,-2.129; 9 -8.898,-3.399; 10 -8.898,-4.669; 11 -8.898,-5.939; 12 -8.898,-7.209; 13 -8.898,-8.479; 14 -8.898,-9.749; 25 8.702,-9.749; 26 8.702,-8.479; 27 8.702,-7.209; 28 8.702,-5.939; 29 8.702,-4.669; 30 8.702,-3.399; 31 8.702,-2.129; 32 8.702,-0.859; 33 8.702,0.411; 34 8.702,1.681; 35 8.702,2.951; 36 8.702,4.221; 37 8.702,5.491; 38 8.702,6.761 | smd 0.7 x 1.5: 15 -5.808,-11.349; 16 -4.538,-11.349; 17 -3.268,-11.349; 18 -1.998,-11.349; 19 -0.728,-11.349; 20 0.542,-11.349; 21 1.812,-11.349; 22 3.082,-11.349; 23 4.352,-11.349; 24 5.622,-11.349 | smd 1 x 1: 41 -0.484,-0.402; 42 1.016,-0.402; 43 -1.984,-0.402; 44 -1.984,-1.902; 45 -0.484,-1.902; 46 1.016,-1.902; 47 1.016,1.098; 48 -0.484,1.098; 49 -1.984,1.098
SOP23-5 = smd 1 x 0.635: 1 -1.27,1; 2 -1.27,0; 3 -1.27,-1; 4 1.27,-1; 5 1.27,1

### Placement (x,y rotation side)
C1  66.54,35.51 270 top
C2  69.08,35.51 270 top
C3  11.47,39.78 0 top
C4  13.02,24.82 0 top
C5  2.92,20.54 0 top
C6  13.84,3.07 90 top
C7  24.63,9.83 180 top
C8  24.63,12.72 180 top
C9  24.61,11.45 180 top
C10  36.23,18.65 270 top
C11  20.52,39.85 0 top
C12  56.47,5.04 0 top
C13  44.88,30.94 90 top
C14  68.03,3.47 180 top
C15  40.59,30.95 270 top
C16  24.63,13.98 180 top
C17  67.81,35.51 270 top
C18  21,26.55 270 top
C19  19.73,26.55 270 top
C20  18.46,26.55 270 top
C21  17.19,26.55 270 top
C22  13.05,17.39 0 top
C23  24.6,15.23 180 top
C24  2.92,18.7 0 top
C25  14.26,12.56 90 top
C26  24.65,30.63 0 top
C27  12.58,12.65 270 top
C28  44.42,18.65 270 top
C42  15.82,3.33 90 top
C46  60.79,10.67 90 top
C51  59.48,10.67 270 top
C53  68.05,2.11 0 top
C54  34.94,18.65 90 top
C55  56.47,6.47 0 top
D2  13.34,7.78 270 top
D3  17.48,10.8 270 top
J1  27.66,24.07 90 bottom
J3  7.79,31.57 270 top
J5  7.84,13.34 270 top
J6  46.7,37.16 0 top
J7  61.57,37.16 0 top
J8  50.47,7.78 0 top
J10  31.74,37.16 0 top
K1  9.46,42.06 0 top
K4  18.2,42.21 0 top
L4  24.04,4.56 180 top
LED1  2.01,23.19 90 top
Q3  11.07,3.32 270 top
Q6  13.24,21.07 270 top
Q9  31.82,31.13 270 top
Q10  35.43,31.04 270 top
R1  47.76,30.97 90 top
R2  49.06,30.97 90 top
R3  3.46,23.21 90 top
R4  17.47,39.83 0 top
R5  45.82,18.65 90 top
R6  9.22,6.26 0 top
R7  13.07,18.82 180 top
R8  42.99,18.65 270 top
R9  7.21,22.22 180 top
R10  13.05,15.97 180 top
R11  11.11,33.64 270 top
R12  63.35,10.67 270 top
R16  40.11,18.65 270 top
R17  32.22,18.65 270 top
R18  46.33,30.94 90 top
R19  62.08,10.67 270 top
R20  21.77,10.37 270 top
R21  20.42,10.37 90 top
R22  67.99,4.76 180 top
R23  37.6,18.65 270 top
R24  33.58,18.65 270 top
R25  9.22,7.78 180 top
R26  41.96,30.95 270 top
R27  43.44,30.95 270 top
R28  30.73,18.65 90 top
R29  41.42,18.65 270 top
R30  56.44,7.89 180 top
R31  56.5,3.66 180 top
R32  11.11,30.74 90 top
R33  13.05,26.23 0 top
R34  11.11,36.59 270 top
R35  15.78,26.55 270 top
R37  67.97,6.07 0 top
R38  13.05,23.34 180 top
R67  38.93,18.65 270 top
R71  65.98,10.67 270 top
R72  64.65,10.67 270 top
R74  27.62,31.13 270 top
R75  29.13,31.13 90 top
SD1  33.99,15.13 270 top
U1  18.64,3.68 0 top
U2  62.34,4.13 90 top
U3  18.11,20.27 180 top
U6  17.16,33.73 180 top
U24  62.4,22.69 270 top
U26  6.95,19.62 0 top
U$2  [2.4板框]  81.81,19.57 0 bottom  (outside the outline)
U$3  [LOGE-2.0]  24.96,24.4 0 top
U$37  [LOGLE]  37.55,24.15 0 top

### Tracks (layer width: path | path; a pad name or v marks a point on that pad's centre or on a via)
3.3V
  Top 0.254: R31.1 57.26,4.51 | 57.26,5.02 C12.2
  Top 0.5: U2.6 57.52,4.77 57.26,4.51 | R31.1 57.26,5.02 | C55.2 C12.2
3V3  (via drill 0.35)  (15 unrouted)
  Top 0.203: 23.74,11.35 C9.2 23.87,11.48 | C8.2 23.84,12.69
  Top 0.254: SD1.4 35.09,16.35 36.23,17.49 C10.2 | v55.71,2.69 55.73,2.69 | C22.2 13.71,17.39 R10.2 13.19,15.07 14.91,15.07 16.26,16.42 | C3.2 12.28,39.83 | U6.16 21.61,30.72 | 21.61,30.51 20.66,29.57 16.86,29.57 15.78,28.49 R35.1 15.36,27.31 14.64,26.59 14.64,25.34 14.12,24.82 C4.2 | R67.1 40.08,19.42 40.1,19.4 | U3.9 U3.10
  Top 0.3: 36.23,18.01 34.94,19.31 | 37.6,19.33 36.23,17.97 | 41.43,18 40.11,19.32 | 11.52,38.82 6.75,38.82 4.99,37.06 4.99,25.5 R3.2 | R29.2 R8.2
  Top 0.35: 43.44,30.25 C13.2
  Top 0.5: 55.73,2.69 R31.2 | v34.81,2.97 31.05,6.72 L4.2 | C23.2 23.84,15.38 23.64,15.58 17.08,15.58 16.81,15.85 16.81,17.04 | C3.2 12.23,39.53 11.52,38.82 | 12.28,39.83 R4.1 16.7,38.48 17.8,37.39 U6.4 17.8,34.13 18.16,33.77 20.81,33.77 21.61,32.97 U6.16 | C54.2 34.94,19.31 | 37.6,19.33 R23.1 R16.1 | C10.2 36.23,17.97 36.23,18.01 | 40.1,19.4 40.09,19.4 R16.1 | R16.1 40.11,19.32 | 41.43,18 R29.2 | C15.2 R27.2 43.44,30.25 | 23.57,22.88 v22.51,22.88 22.48,22.91 20.75,22.91
  Top 0.8: 23.84,6.93 C23.2 | C9.2 23.53,11.14 R20.1 | 21.61,30.51 U6.16 | J6.3 47.7,41.57 47.46,41.82 | 62.57,40.67 J7.3 62.57,35.95 63.86,34.67 69,34.67 C2.2 | C17.2 67.81,31.66 U24.2 | 23.84,30.97 23.59,30.72 21.61,30.72 | 23.57,22.88 23.84,22.62
  Top 1: C23.2 23.84,17.4 | 23.84,17.4 26.76,20.32 29.83,20.32 R28.2 C54.2 | 23.84,17.4 23.84,22.62 23.84,30.97 23.84,36.3 29.36,41.82 32.86,41.82 | 32.86,41.82 47.46,41.82 61.42,41.82 62.57,40.67 | J6.3 47.7,31.79 R1.2 44.91,31.73 C13.2 | 32.86,41.82 32.74,41.7 J10.3
  Bottom 0.254: J1.P$10 23.55,24.48 22.51,23.43 v22.51,22.88 23.3,23.68 J1.P$9 | v21.66,22.87 21.67,22.88
  Bottom 0.5: v55.71,2.69 54.59,2.69 54.31,2.97 v34.81,2.97 | 21.67,22.88 v22.51,22.88
  pour Top (no thermals): 25.36,20.67 26.86,20.67 24.26,18.07 24.16,18.07 24.16,21.27
  pour Top: 22.16,30.62 23.61,29.17 23.61,31.87 22.36,30.62
  pour Top: 32.71,40.07 34.16,41.52 31.46,41.52 32.71,40.27
  pour Top (no thermals): 47.76,40.07 49.21,41.52 46.51,41.52 47.76,40.27
AGND  (2 unrouted)
  Top 0.254: C46.1 59.48,11.23 C51.1 59.48,11.48 | 57.07,7.89 R30.1 | C53.2 68.81,1.32 | U2.1 63.55,2.23 62.09,3.69 59.85,3.69 U2.7 | J8.P$4 53.82,3.85
  Top 0.5: C51.1 59.39,11.52 59.31,11.52 58.02,10.24 58.02,8.74 57.16,7.87 | C12.1 C55.1 55.76,6.47 57.17,7.89 R30.1 | 68.81,1.32 68.16,0.67 66.76,0.67 65.2,2.23 U2.1 64.86,2.23 63.35,0.72 55.17,0.72 J8.P$4
  Top 0.58: C12.1 55.01,5.04 53.82,3.85
BAT+  (1 unrouted)
  Top 1: Q3.3 11.09,4.51 12.33,5.75 D2.A 13.58,5.75 13.93,6.1 13.48,6.1 10.97,8.61 10.97,12.91 9.55,14.34 J5.P$1 6.67,14.34 5.69,15.31 5.69,18.28 5.37,18.6 3.91,18.6 C24.2 C5.2
BYPASS_IN+
  Top 0.254: U2.3 U2.2 65.02,3.52 65.53,3.52 66.98,2.06 67.23,2.06 C53.1
D+
  Top 0.254: R32.1 10.58,29.98 9.74,30.82 J3.B6 7.33,30.82 6.99,31.15 6.99,31.57 7.25,31.82 J3.A6
D-
  Top 0.254: J3.B7 9.29,32.32 9.3,32.33 9.42,32.2 | R11.1 10.36,34.4 10.02,34.06 10.02,32.8 9.42,32.2 | J3.A7 9.31,31.32 9.56,31.57 9.56,32.07 9.42,32.2
DTR  (via drill 0.35)
  Top 0.254: U6.13 v17.8,32.55 v17.79,32.56 | v28.29,33.14 29.21,32.22 29.21,31.97 R75.2
  Top 0.3: Q10.2 34.41,29.67 33.52,28.78 v32.83,28.78
  Bottom 0.254: v17.79,32.56 17.79,32.72 18.4,33.34 28.1,33.34 v28.29,33.14
  Bottom 0.3: v32.83,28.78 28.46,33.14 v28.29,33.14
EN_RESET  (via drill 0.35)
  Top 0.254: U24.3 66.63,31.57 66.63,30.52 63.82,27.7 60.99,27.7 59.27,25.98 v59.27,21.41 | C11.1 18.26,39.85 R4.2 | C11.1 22.12,42.22 K4.2 | C11.1 22.41,42.51 v26.72,42.51 | Q9.3 32.83,29.95 32.08,29.2 32.08,28.36 32.41,28.02 37.11,28.02 39.27,30.18 v39.27,31.36
  Top 0.3: v49.37,21.22 | v49.37,21.22 46.85,21.22 45.76,20.12 45.76,19.47 R5.2
  Bottom 0.254: v59.27,21.41 54.7,25.98 43.14,25.98 39.27,29.84 v39.27,31.36 39.27,33.81 30.58,42.51 v26.72,42.51
  Bottom 0.3: v59.27,21.41 59.16,21.29 49.45,21.29 v49.37,21.22
GND  (via drill 0.35, 3.2 pad 5.2)
  Top 0.152: v67.97,10.99 67.97,9.39 73.3,4.06 v73.3,3.53
  Top 0.254: SD1.6 32.89,15.84 C54.1 | SD1.G3 48.41,4.76 50.06,3.12 52.11,3.12 52.61,3.62 52.61,5.27 55.23,7.89 R30.2 | U24.49 63.5,25.36 67.63,29.49 | 68.23,16.94 U24.47 | LED1.- 4.07,26.02 J3.P$9 | C17.1 C2.1
  Top 0.8: 67.63,29.49 67.97,29.49 68.76,30.28 68.82,30.28 69.16,30.62 U24.1 69.16,29.67 68.16,28.67 | 69.16,16.01 68.23,16.94
  Top 1: 69.11,12.33 69.11,13.93 U24.38 69.16,16.01
  other vias: 36.71,38.54 3.55,3.53 15.14,43.71 51.92,29.73 12.74,37.95 15.71,38.09 3.55,43.26 73.3,43.26 46.68,43.79 67.03,20.09 67.13,23.74 67.08,27.79 46.33,5.74 64.58,16.74 60.53,17.34 26.73,4.64 20.46,6.05 41.45,37.1 33.09,11.93 55.71,38.18 52.56,37.62 22.28,4.64 17.83,28.54 12.31,28.8 36.47,32.77 44.63,33.09 9.03,36.79 11.13,17.49 11.11,20.07 38.49,28.01 65.13,41.49 49.78,40.24 8.98,40.04 34.73,39.94 19.08,28.54 58.68,40.09 16.6,42.93 31.33,43.69 61.43,26.29 66.43,38.09 36.93,5.79 65.13,33.34 67.73,38.14 35.87,33.92 63.73,26.29 21.63,21.39 30.54,27.74 28.71,28.13 19.14,37.83 22.24,16.73 18.99,10.68 20.49,3.73 15.1,29.14 8.66,25.63 50.61,13.72 29.49,9.93 8.73,10.07 33.83,11.34 40.99,16.46 16.09,21.08 35.04,4.53 11.39,24.13 11.14,27.48 29.3,16.83 26.84,9.98 50.94,34.58 29.49,11.13 30.58,10.67 49.64,33.33 8.71,24.13 23.83,39.57 26.3,35.91 8.71,17.46 8.8,11 9.64,10.95 8.71,37.8 9.78,37.84 9.08,35.64
  pour Top (rank 2): -0.04,47.02 76.86,47.02 76.91,47.07 76.91,40.55 69.61,40.55 69.61,6.5 76.86,6.5 76.86,0.02 0.01,0.02 -0.04,-0.03
  pour Bottom (rank 2): -0.04,47.02 76.86,47.02 76.91,47.07 76.91,40.55 69.61,40.55 69.61,6.5 76.86,6.5 76.86,0.02 0.01,0.02 -0.04,-0.03
IN-
  Top 0.254: 67.06,6.07 66.89,6.07 65.03,6.07 U2.4 | R37.1 67.06,6.07 | R22.2 67.06,4.93 67.06,6.07
IO0_BOOT  (via drill 0.35)
  Top 0.254: U24.25 52.65,24.68 v52.74,24.78 | v15.01,41.17 14.36,41.17 K1.2 | v38.09,30.85 37.89,31.04 Q10.3
  Bottom 0.254: v52.74,24.78 43.07,24.78 38.09,29.76 v38.09,30.85 38.09,33.12 30.04,41.17 v15.01,41.17
IO2_TFT_RS  (via drill 0.35)
  Top 0.254: v46.93,19.64 49.5,17.06 U24.24
  Bottom 0.254: v46.93,19.64 46.74,19.83 26.27,19.83 J1.P$4
IO4_TFT_SDO/TP_OUT  (via drill 0.35)
  Top 0.254: U24.26 53.92,15.58 v53.54,15.97 | v18.13,18.86 18.13,16.98 U3.12
  Bottom 0.254: v53.54,15.97 49.76,15.97 47.95,14.16 19.47,14.16 18.13,15.5 v18.13,18.86
IO5_TF_CS
  Top 0.254: R67.2 37.29,16.26 SD1.2 37.29,13.13 37.71,12.72 57.24,12.72 57.74,13.22 57.74,13.97 U24.29
IO12
  Top 0.254: U24.14 50.63,31.58 49.26,30.21 R2.1
IO13_TFT_SDI/TP_DIN  (via drill 0.35)
  Top 0.254: R29.1 41.43,21 41.63,21.2 v41.63,21.36 42.38,22.12 48.76,22.12 49.57,22.93 49.57,26.69 50.2,27.32 50.95,27.32 U24.16 | U3.14 19.38,19.34 v19.66,19.62
  Bottom 0.254: v41.63,21.36 41.63,21.28 J1.P$6 22.97,21.28 22.06,20.37 20.41,20.37 v19.66,19.62
IO14_TFT_CLK/TP_CLK  (via drill 0.35)
  Top 0.254: U24.13 53.92,29.93 55.84,28.01 v55.84,20.23 | R28.1 30.32,17.89 29.37,18.85 v29.14,18.85 | U3.16 20.65,17.62 21.5,18.47 v22.36,18.47
  Bottom 0.254: v55.84,20.23 55.78,20.29 50.19,20.29 48.64,18.74 29.24,18.74 v29.14,18.85 29.1,18.88 J1.P$3 22.77,18.88 v22.36,18.47
IO15_TFT_CS  (via drill 0.35)
  Top 0.254: v48.28,20.15 50.09,18.33 U24.23
  Bottom 0.254: v48.28,20.15 47.81,20.62 26.26,20.62 J1.P$5
IO16_RXD2  (via drill 0.35)
  Top 0.254: U24.27 55,14.17 55,15.51 53.47,17.03 v53.47,22.38 | v28.75,35.12 v28.76,35.12 28.76,37.04 J10.1
  Bottom 0.254: v53.47,22.38 53.31,22.55 40.06,22.55 28.75,33.86 v28.75,35.12
IO17_TXD2  (via drill 0.35)
  Top 0.254: U24.28 56.37,14.07 56.37,15.11 54.36,17.12 v54.36,23.57 | v30.72,35.14 30.74,35.14 J10.2
  Bottom 0.254: v30.72,35.14 30.72,33.61 40.76,23.57 v54.36,23.57
IO18_TF_SPI_CLK
  Top 0.254: U24.30 59.01,13.97 59.01,13.22 56.75,10.96 35.41,10.96 33.99,12.38 SD1.5
IO19_TF_SPI_MISO
  Top 0.254: R24.2 33.58,17.63 31.79,15.84 SD1.7 31.83,15.09 31.83,11.72 33.2,10.35 57.09,10.35 60.27,13.53 U24.31
IO21_SCL  (via drill 0.35)  (2 unrouted)
  Top 0.254: U24.33 62.81,19.06 v62.01,19.87 | R26.1 41.96,34.57 43.86,36.47
  Bottom 0.254: v62.01,19.87 62.01,20.46 55.41,27.05 44.72,27.05 41.96,29.82 41.96,32.74 v41.99,32.77
IO22_SDA  (via drill 0.35)  (3 unrouted)
  Top 0.254: U24.36 66.62,16.85 v63.41,20.07 | R27.1 43.44,33.85 45.51,35.92
  Bottom 0.254: v63.41,20.07 63.41,20.37 55.86,27.92 45.16,27.92 43.41,29.67 43.41,33.02
  other vias: 43.43,33.04
IO23_TF_SPI_MOSI  (via drill 0.35)
  Top 0.254: R23.2 36.19,16.49 SD1.3 36.19,12.38 36.81,11.77 v56.41,11.77 | U24.37 67.89,12.42 v67.48,12.02
  Bottom 0.254: v67.48,12.02 67.48,11.94 66.64,11.1 57.08,11.1 v56.41,11.77
IO25_PROT_A/D  (via drill 0.35)  (1 unrouted)
  Top 0.254: v57.69,30.12 57.73,30.16 U24.10 57.73,35.54 58.66,36.47 | R18.1 46.33,29.28 v46.44,29.16
  Bottom 0.254: v57.69,30.12 57.05,30.76 47.9,30.76 46.44,29.3 v46.44,29.16
IO26_SPEAK  (via drill 0.35)
  Top 0.254: U24.11 56.46,29.68 57.07,29.08 57.07,18.49 v59.6,15.96 | v63.18,12.46 63.28,12.36 63.28,11.5 R12.1
  Bottom 0.254: v63.18,12.46 59.68,15.96 v59.6,15.96
IO27_LCD_BLK_CTR  (via drill 0.35)  (1 unrouted)
  Top 0.254: U24.12 55.19,30.25 56.58,28.86 56.58,16.19 v56.92,15.85 | v14.95,23.39 13.9,23.39 12.48,21.96 Q6.1
  Bottom 0.254: v56.92,15.85 55.66,14.59 50.39,14.59 48.57,12.77 18.4,12.77 14.95,16.21 v14.95,23.39
IO32_PROT_A/D  (via drill 0.35)  (1 unrouted)
  Top 0.254: v60.11,29.57 60.27,29.73 U24.8 60.27,36.18 60.61,36.52 | v49.06,28.97 48.47,28.97 47.76,29.68 R1.1
  Bottom 0.254: v49.06,28.97 59.51,28.97 v60.11,29.57
IO33_TP_CS  (via drill 0.35)
  Top 0.254: U24.9 59,29.68 57.85,28.53 57.85,19.26 v57.79,19.2 | U3.15 20.01,18.05 v20.92,18.96
  Bottom 0.254: v57.79,19.2 50.42,19.2 46.76,15.54 21.35,15.54 20.92,15.96 20.92,17.37 v20.92,18.96
IO36_TP_IRQ  (via drill 0.35)
  Top 0.254: v58.61,18.02 58.52,18.1 58.52,26.08 60.78,28.33 63.48,28.33 65.35,30.2 U24.4 | R10.1 15.16,17.32 15.16,17.82 16.06,18.72 v16.76,18.72 17.47,18 U3.11
  Bottom 0.254: v58.61,18.02 58.02,18.02 55.13,15.13 49.73,15.13 48.25,13.65 18.86,13.65 16.75,15.76 16.76,15.77 v16.76,18.72
N$1
  Top 0.254: 2.11,22.53 LED1.+
  Top 1: R3.1 2.19,22.45 2.11,22.53
N$2
  Top 0.254: R7.2 12.48,18.82 14.26,20.6 Q6.3
N$3
  Top 0.254: R12.2 63.35,10 62.08,11.27 R19.1 C46.2
N$4
  Top 0.254: U3.7 16.84,23.45 15.78,24.51 R35.2
N$6
  Top 1: U26.5 8.22,21.97 R9.1
N$12  (via drill 0.35)  (2 unrouted)
  Top 0.254: R7.1 14.88,18.82 16.18,20.12 v17.56,20.12
  Bottom 0.254: J1.P$14 J1.P$11 | J1.P$11 | v17.56,20.12 17.66,20.12 22.81,25.27 J1.P$11
N$13  (1 unrouted)
  Top 0.8: U1.3 23.96,2.48
N$14
  Top 0.254: J3.B5 9.95,29.82 12.28,27.49 R33.1
N$16
  Top 0.254: J3.A5 8.31,32.84 9.33,32.84 9.54,33.05 9.54,34.4 10.96,35.82 R34.2
N$17
  Top 0.5: Q3.1 9.98,2.21 R6.2 R25.1
N$20
  Top 0.254: U1.5 17.78,4.88 20.42,7.53 R21.1 R20.2
N$26
  Top 0.254: C51.2 59.48,9.25 59.99,8.73 61.52,8.73 62.08,9.29 R19.2 62.08,9.66 64.04,7.7 68.72,7.7 70.06,6.37 70.06,3.92 69.61,3.47 C14.1
N$29
  Top 0.254: C14.2 68.55,4.76 R22.1
N$32
  Top 0.254: R75.1 29.13,30.41 Q9.1
N$38
  Top 0.3: R74.1 27.37,32.14 27.37,33.31 27.94,33.89 33.59,33.89 34.41,33.07 Q10.1
N$40  (via drill 0.35)
  Top 0.254: R72.2 64.65,9.36 v64.11,8.82 | U6.2 20.48,36.07 v20.48,34.97
  Bottom 0.254: v64.11,8.82 17.35,8.82 13.91,12.27 13.91,30.07 17.72,33.88 19.38,33.88 v20.48,34.97
N$42  (via drill 0.35)
  Top 0.254: R71.2 65.98,9.09 v65.61,8.72 | v19.06,34.92 U6.3
  Bottom 0.254: v65.61,8.72 65.61,8.07 64.86,7.32 17.46,7.32 13.06,11.72 13.06,30.75 17.22,34.92 v19.06,34.92
N$47
  Top 0.254: R16.2 39.9,17.69 39.9,17.14 38.39,15.63 SD1.1
N$48
  Top 0.254: SD1.8 30.69,15.93 32.22,17.46 R17.2
RTS  (via drill 0.35)
  Top 0.254: R74.2 26.19,31.79 v26.19,32.47 | v19.13,32.56 19.07,32.49 U6.14
  Top 0.3: R74.2 27.62,29.53 28.12,29.03 30.14,29.03 30.8,29.69 Q9.2
  Bottom 0.254: v26.19,32.47 26.11,32.56 v19.13,32.56
TFT_RESET  (via drill 0.35)
  Top 0.3: R8.1 C28.1 44.42,19.36 45.82,17.96 R5.1 45.82,16.74 v45.76,16.68
  Bottom 0.3: J1.P$2 26.2,17.99 44.45,17.99 v45.76,16.68
TP_X+  (via drill 0.35)
  Top 0.254: 21,24.49 C18.2 21.03,25.82 21.11,25.82 | 21,24.49 20.01,23.5 U3.2 | v22.01,25.82 21.11,25.82 | 21,24.49 21.11,24.6 21.11,25.82
  Bottom 0.254: J1.P$15 23.92,28.48 22.01,26.57 v22.01,25.82
TP_X-  (via drill 0.35)
  Top 0.254: C20.2 18.44,25.76 18.44,24.63 v18.58,24.49 18.74,24.33 U3.4
  Bottom 0.254: J1.P$17 23.21,30.08 20.51,27.37 20.51,24.53 20.01,24.03 19.04,24.03 v18.58,24.49
TP_Y+  (via drill 0.35)
  Top 0.254: C19.2 19.72,24.83 v19.68,24.79 19.66,24.77 19.42,24.53 19.38,24.49 U3.3
  Bottom 0.254: v19.68,24.79 19.68,27.69 22.87,30.87 J1.P$18
TP_Y-  (via drill 0.35)
  Top 0.254: C21.2 17.19,24.6 v17.28,24.51 18.11,23.68 U3.5
  Bottom 0.254: J1.P$16 23.27,29.28 21.01,27.02 21.01,24.15 20.28,23.41 18.38,23.41 v17.28,24.51 | v17.28,24.51
UART0_RXD0
  Top 0.254: R72.1 64.08,12 U24.34
UART0_TXD0
  Top 0.254: R71.1 65.35,12.06 U24.35
USB_D+
  Top 0.254: R32.2 11.2,31.59 12.83,33.22 14.81,33.22 16.53,34.93 U6.5
USB_D-
  Top 0.254: R11.2 11.56,32.87 12.56,33.87 14.66,33.87 15.25,34.46 U6.6
VBUS  (via drill 0.35)  (8 unrouted)
  Top 0.5: R25.2 8.46,8.53 9.05,9.12 v9.47,9.12
  Top 0.6: 8.14,29.17 7.19,29.17 | 7.99,33.97 7.23,33.97 | 8.45,29.17 9.36,29.17
  Top 0.65: 7.19,29.17 6.29,30.07 6.29,33.15 7.16,34.02 | 9.36,29.17 10.01,28.52
  Top 0.8: 16.57,13.3 17.21,13.3
  Top 1: 10.01,28.52 10.01,18.61 | 10.01,18.61 10.01,16 | 10.01,16 10.01,15.84 12.38,13.47 13,13.47 17.04,13.47 17.21,13.3 D3.1 | 10.01,16 9.67,16.34 v9.14,16.34 | 10.01,18.61 U26.4
  Bottom 0.5: v9.47,9.12 9.56,9.12 10.9,10.46 10.9,13.49 9.05,15.34 9.05,16.26 v9.14,16.34
VIN
  Top 0.5: U1.1 17.69,2.98 U1.4
  Top 0.65: D3.2 17.12,7.94 17.31,7.75 | C42.2 16.37,4.22 17.69,2.9 U1.1
  Top 1: 17.31,7.75 17.31,7.12 15.82,5.63 C42.2 15.43,3.84 C6.2 13.19,3.84 12.07,2.71 Q3.2 | D3.2 15.98,9.8 D2.C
VO1  (via drill 0.5)
  Top 0.254: v49.41,5.42 49.47,5.48 | U2.5 59.64,6.07 | 68.74,6.12 R37.2
  Top 0.5: J8.P$1 49.47,5.48 | 59.64,6.07 v58.37,6.07 | U2.5 60.66,7.04 67.82,7.04 68.74,6.12
  Bottom 0.5: v58.37,6.07 57.98,5.67 49.66,5.67 v49.41,5.42
VO2  (via drill 0.5)  (1 unrouted)
  Top 0.254: v61.53,2.79 60.98,2.23 U2.8 | 51.41,6.77 51.61,6.97
  Top 0.5: v51.41,4.22 51.41,6.77
  Bottom 0.5: v61.53,2.79 60.1,4.22 v51.41,4.22

### Text on the board
tPlace: 3V3 | IO16_RXD | IO17_TXD | 3V3 | GND | IO21_SCL | IO22_SDA | 3V3 | GND | IO25 | IO32 | GND | + | V1.0 | IO26-SPK | VO1 | VO2 | -
tStop: ESP32 Miner LCD-2.4 inch | SKU:DHM04624D